# Altium project Motor_Driver_UCC272201ADR.PrjPcb
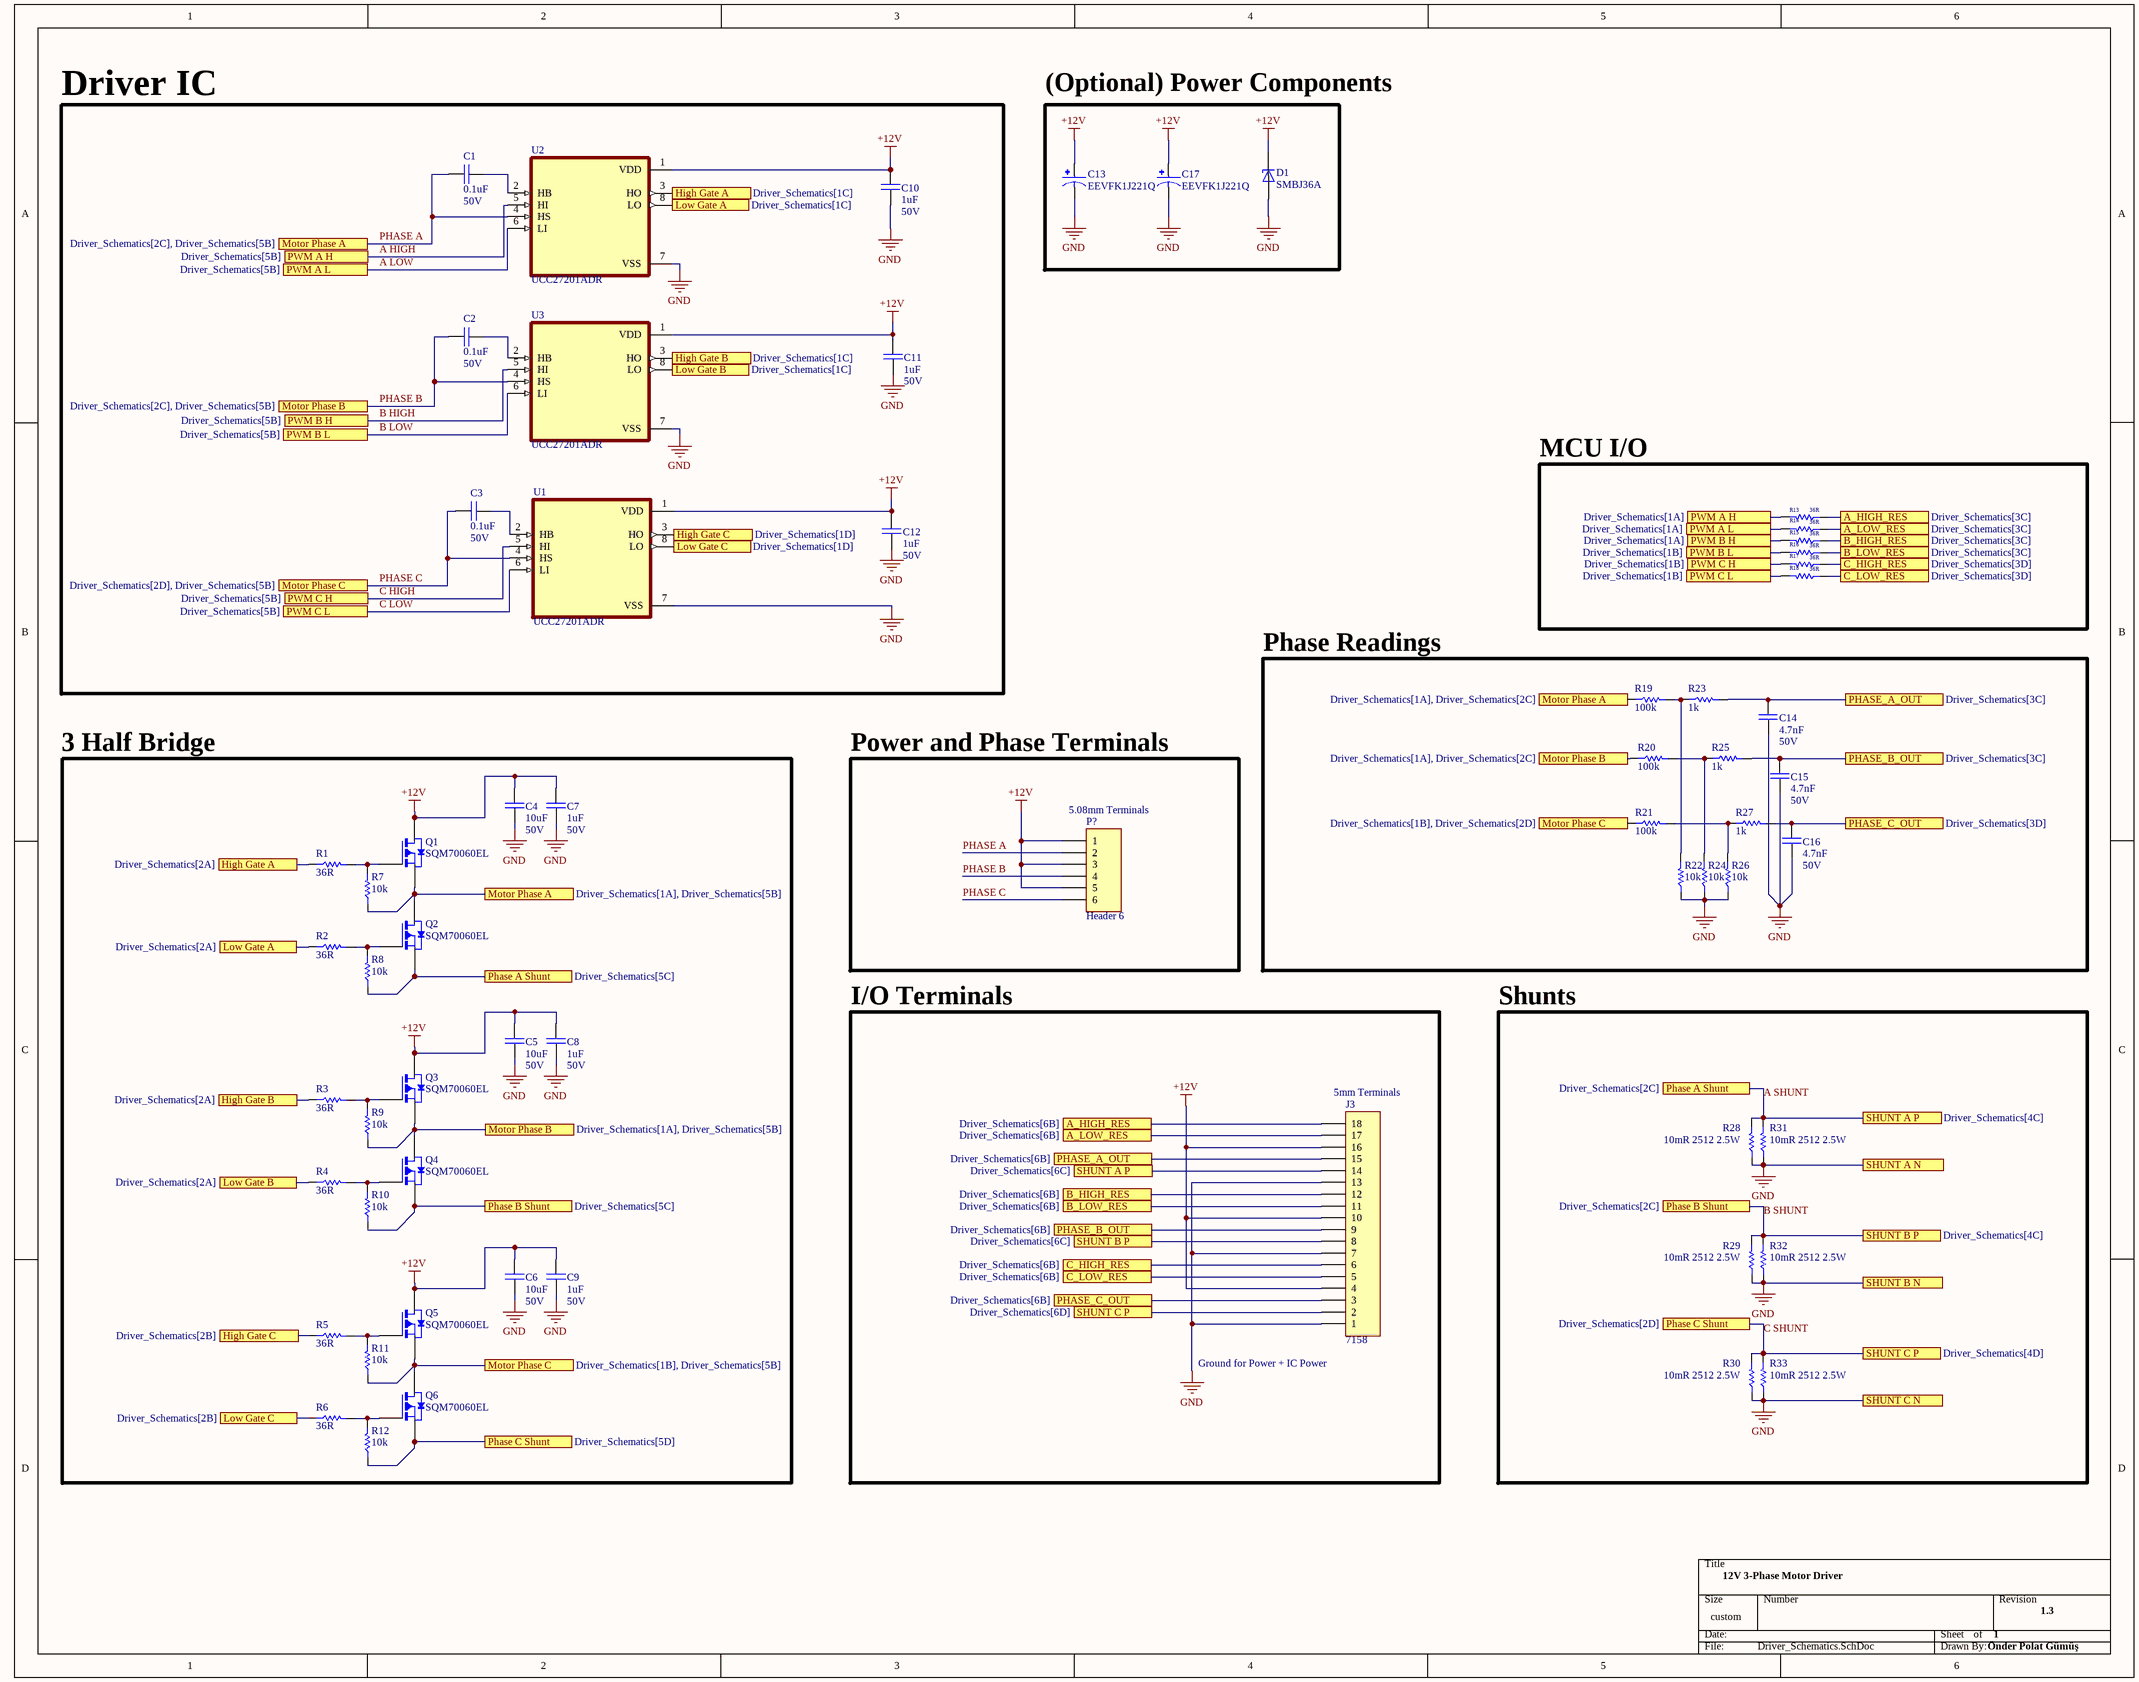
[diagram p0: Driver_Schematics.SchDoc]
1 sheet, 62 parts. Net scope: flat (ports and power ports of the same name join across sheets).
Board file: One_Layer_Driver_ PCB.PcbDoc

## Sheet Driver_Schematics.SchDoc
size 457 x 360 mm; SheetNumber: 1; SheetTotal: 1; SPICEModelCacheHAKLBCCJ: <root> / <DocumentId>HAKLBCCJ</DocumentId> / </root>

### Parts
C1  Rating: 50V  [CAP 1206/3216]  (hidden comment: 0.1uF)
C2  Rating: 50V  [CAP 1206/3216]  (hidden comment: 0.1uF)
C3  Rating: 50V  [CAP 1206/3216]  (hidden comment: 0.1uF)
C4  Rating: 50V  [CAP 1206/3216]  (hidden comment: 10uF)
C5  Rating: 50V  [CAP 1206/3216]  (hidden comment: 10uF)
C6  Rating: 50V  [CAP 1206/3216]  (hidden comment: 10uF)
C7  Rating: 50V  [CAP 1206/3216]  (hidden comment: 1uF)
C8  Rating: 50V  [CAP 1206/3216]  (hidden comment: 1uF)
C9  Rating: 50V  [CAP 1206/3216]  (hidden comment: 1uF)
C10  Rating: 50V  [CAP 1206/3216]  (hidden comment: 1uF)
C11  Rating: 50V  [CAP 1206/3216]  (hidden comment: 1uF)
C12  Rating: 50V  [CAP 1206/3216]  (hidden comment: 1uF)
C13  EEVFK1J221Q  [CAP_EEVFK1J221Q]
C14  Rating: 50V  [CAP 1206/3216]  (hidden comment: 4.7nF)
C15  Rating: 50V  [CAP 1206/3216]  (hidden comment: 4.7nF)
C16  Rating: 50V  [CAP 1206/3216]  (hidden comment: 4.7nF)
C17  EEVFK1J221Q  [CAP_EEVFK1J221Q]
D1  SMBJ36A  [DIOM4336X265N]
J3  Inflow: 7158  [HDR_THT_18F_2.54mm_RA]  (hidden comment: 18)
P?  Header 6  [HDR1X6]
Q1  SQM70060EL  [TO-263]
Q2  SQM70060EL  [TO-263]
Q3  SQM70060EL  [TO-263]
Q4  SQM70060EL  [TO-263]
Q5  SQM70060EL  [TO-263]
Q6  SQM70060EL  [TO-263]
R1  36R  [RES 1206 (3216X08L)]
R2  36R  [RES 1206 (3216X08L)]
R3  36R  [RES 1206 (3216X08L)]
R4  36R  [RES 1206 (3216X08L)]
R5  36R  [RES 1206 (3216X08L)]
R6  36R  [RES 1206 (3216X08L)]
R7  10k  [RES 1206 (3216X08L)]
R8  10k  [RES 1206 (3216X08L)]
R9  10k  [RES 1206 (3216X08L)]
R10  10k  [RES 1206 (3216X08L)]
R11  10k  [RES 1206 (3216X08L)]
R12  10k  [RES 1206 (3216X08L)]
R13  36R  [RES 1206 (3216X08L)]
R14  36R  [RES 1206 (3216X08L)]
R15  36R  [RES 1206 (3216X08L)]
R16  36R  [RES 1206 (3216X08L)]
R17  36R  [RES 1206 (3216X08L)]
R18  36R  [RES 1206 (3216X08L)]
R19  100k  [RES 1206 (3216X08L)]
R20  100k  [RES 1206 (3216X08L)]
R21  100k  [RES 1206 (3216X08L)]
R22  10k  [RES 1206 (3216X08L)]
R23  1k  [RES 1206 (3216X08L)]
R24  10k  [RES 1206 (3216X08L)]
R25  1k  [RES 1206 (3216X08L)]
R26  10k  [RES 1206 (3216X08L)]
R27  1k  [RES 1206 (3216X08L)]
R28  10mR 2512 2.5W  [Shunt_2512]
R29  10mR 2512 2.5W  [Shunt_2512]
R30  10mR 2512 2.5W  [Shunt_2512]
R31  10mR 2512 2.5W  [Shunt_2512]
R32  10mR 2512 2.5W  [Shunt_2512]
R33  10mR 2512 2.5W  [Shunt_2512]
U1  UCC27201ADR  [SOIC127P599X175-8N]
U2  UCC27201ADR  [SOIC127P599X175-8N]
U3  UCC27201ADR  [SOIC127P599X175-8N]

### Blocks framed on the sheet
Driver IC: C1-C3 C10-C12 U1-U3
(Optional) Power Components: C13 C17 D1
MCU I/O: R13-R18
Phase Readings: C14-C16 R19-R27
3 Half Bridge: C4-C9 Q1-Q6 R1-R12
Power and Phase Terminals: P?
I/O Terminals: J3
Shunts: R28-R33

### Ports
A_HIGH_RES (see Driver_Schematics[3C]), A_HIGH_RES (see Driver_Schematics[6B]), A_LOW_RES (see Driver_Schematics[3C]), A_LOW_RES (see Driver_Schematics[6B]), B_HIGH_RES (see Driver_Schematics[3C]), B_HIGH_RES (see Driver_Schematics[6B]), B_LOW_RES (see Driver_Schematics[3C]), B_LOW_RES (see Driver_Schematics[6B]), C_HIGH_RES (see Driver_Schematics[3D]), C_HIGH_RES (see Driver_Schematics[6B]), C_LOW_RES (see Driver_Schematics[3D]), C_LOW_RES (see Driver_Schematics[6B]), High Gate A (see Driver_Schematics[1C]), High Gate A (see Driver_Schematics[2A]), High Gate B (see Driver_Schematics[1C]), High Gate B (see Driver_Schematics[2A]), High Gate C (see Driver_Schematics[1D]), High Gate C (see Driver_Schematics[2B]), Low Gate A (see Driver_Schematics[1C]), Low Gate A (see Driver_Schematics[2A]), Low Gate B (see Driver_Schematics[1C]), Low Gate B (see Driver_Schematics[2A]), Low Gate C (see Driver_Schematics[1D]), Low Gate C (see Driver_Schematics[2B]), Motor Phase A (see Driver_Schematics[1A], Driver_Schematics[2C]), Motor Phase A (see Driver_Schematics[1A], Driver_Schematics[5B]), Motor Phase A (see Driver_Schematics[2C], Driver_Schematics[5B]), Motor Phase B (see Driver_Schematics[1A], Driver_Schematics[2C]), Motor Phase B (see Driver_Schematics[1A], Driver_Schematics[5B]), Motor Phase B (see Driver_Schematics[2C], Driver_Schematics[5B]), Motor Phase C (see Driver_Schematics[1B], Driver_Schematics[2D]), Motor Phase C (see Driver_Schematics[1B], Driver_Schematics[5B]), Motor Phase C (see Driver_Schematics[2D], Driver_Schematics[5B]), Phase A Shunt (see Driver_Schematics[2C]), Phase A Shunt (see Driver_Schematics[5C]), Phase B Shunt (see Driver_Schematics[2C]), Phase B Shunt (see Driver_Schematics[5C]), Phase C Shunt (see Driver_Schematics[2D]), Phase C Shunt (see Driver_Schematics[5D]), PHASE_A_OUT (see Driver_Schematics[3C]), PHASE_A_OUT (see Driver_Schematics[6B]), PHASE_B_OUT (see Driver_Schematics[3C]), PHASE_B_OUT (see Driver_Schematics[6B]), PHASE_C_OUT (see Driver_Schematics[3D]), PHASE_C_OUT (see Driver_Schematics[6B]), PWM A H (see Driver_Schematics[1A]), PWM A H (see Driver_Schematics[5B]), PWM A L (see Driver_Schematics[1A]), PWM A L (see Driver_Schematics[5B]), PWM B H (see Driver_Schematics[1A]), PWM B H (see Driver_Schematics[5B]), PWM B L (see Driver_Schematics[1B]), PWM B L (see Driver_Schematics[5B]), PWM C H (see Driver_Schematics[1B]), PWM C H (see Driver_Schematics[5B]), PWM C L (see Driver_Schematics[1B]), PWM C L (see Driver_Schematics[5B]), SHUNT A N, SHUNT A P (see Driver_Schematics[4C]), SHUNT A P (see Driver_Schematics[6C]), SHUNT B N, SHUNT B P (see Driver_Schematics[4C]), SHUNT B P (see Driver_Schematics[6C]), SHUNT C N, SHUNT C P (see Driver_Schematics[4D]), SHUNT C P (see Driver_Schematics[6D])

### Nets
+12V: C4.1 C5.1 C6.1 C7.1 C8.1 C9.1 C10.1 C11.1 C12.1 C13.1 C17.1 D1.C J3.4 J3.10 J3.16 P?.1 P?.3 P?.5 Q1.4(D) Q3.4(D) Q5.4(D) U1.1(VDD) U2.1(VDD) U3.1(VDD)
GND: C4.2 C5.2 C6.2 C7.2 C8.2 C9.2 C10.2 C11.2 C12.2 C13.2 C14.2 C15.2 C16.2 C17.2 D1.A J3.1 J3.7 J3.13 R22.1 R24.1 R26.1 R28.1 R29.1 R30.1 R31.1 R32.1 R33.1 U1.7(VSS) U2.7(VSS) U3.7(VSS) ; port SHUNT A N, port SHUNT B N, port SHUNT C N
A HIGH: R13.1 U2.5(HI) ; port PWM A H
A LOW: R14.1 U2.6(LI) ; port PWM A L
A SHUNT: J3.14 Q2.3(S) R8.1 R28.2 R31.2 ; port Phase A Shunt, port SHUNT A P
B HIGH: R15.1 U3.5(HI) ; port PWM B H
B LOW: R16.1 U3.6(LI) ; port PWM B L
B SHUNT: J3.8 Q4.3(S) R10.1 R29.2 R32.2 ; port Phase B Shunt, port SHUNT B P
C HIGH: R17.1 U1.5(HI) ; port PWM C H
C LOW: R18.1 U1.6(LI) ; port PWM C L
C SHUNT: J3.2 Q6.3(S) R12.1 R30.2 R33.2 ; port Phase C Shunt, port SHUNT C P
PHASE A: C1.1 P?.2 Q1.3(S) Q2.4(D) R7.1 R19.1 U2.4(HS) ; port Motor Phase A
PHASE B: C2.1 P?.4 Q3.3(S) Q4.4(D) R9.1 R20.1 U3.4(HS) ; port Motor Phase B
PHASE C: C3.1 P?.6 Q5.3(S) Q6.4(D) R11.1 R21.1 U1.4(HS) ; port Motor Phase C
NetC1_2: C1.2 U2.2(HB)
NetC2_2: C2.2 U3.2(HB)
NetC3_2: C3.2 U1.2(HB)
NetC14_1: C14.1 J3.15 R23.2 ; port PHASE_A_OUT
NetC15_1: C15.1 J3.9 R25.2 ; port PHASE_B_OUT
NetC16_1: C16.1 J3.3 R27.2 ; port PHASE_C_OUT
NetJ3_5: J3.5 R18.2 ; port C_LOW_RES
NetJ3_6: J3.6 R17.2 ; port C_HIGH_RES
NetJ3_11: J3.11 R16.2 ; port B_LOW_RES
NetJ3_12: J3.12 R15.2 ; port B_HIGH_RES
NetJ3_17: J3.17 R14.2 ; port A_LOW_RES
NetJ3_18: J3.18 R13.2 ; port A_HIGH_RES
NetQ1_1: Q1.1(G) R1.2 R7.2
NetQ2_1: Q2.1(G) R2.2 R8.2
NetQ3_1: Q3.1(G) R3.2 R9.2
NetQ4_1: Q4.1(G) R4.2 R10.2
NetQ5_1: Q5.1(G) R5.2 R11.2
NetQ6_1: Q6.1(G) R6.2 R12.2
NetR1_1: R1.1 U2.3(HO) ; port High Gate A
NetR2_1: R2.1 U2.8(LO) ; port Low Gate A
NetR3_1: R3.1 U3.3(HO) ; port High Gate B
NetR4_1: R4.1 U3.8(LO) ; port Low Gate B
NetR5_1: R5.1 U1.3(HO) ; port High Gate C
NetR6_1: R6.1 U1.8(LO) ; port Low Gate C
NetR19_2: R19.2 R22.2 R23.1
NetR20_2: R20.2 R24.2 R25.1
NetR21_2: R21.2 R26.2 R27.1

### Notes on the sheet
- (near P?) 5.08mm Terminals
- (near J3) 5mm Terminals
- (near J3) Ground for Power + IC Power
- 12V 3-Phase Motor Driver
- 1
- 1.3
- Önder Polat Gümüş

### Library data of the parts
C1-C12 C14-C16 = Cap_Multi_SMD: Bipolar ceramic capacitor SMD; Inflow: inflow?; Type: Type?; Validation: Valid; Package: Package?
  C1-C3: Value: 0.1uF
  C4-C6: Value: 10uF
  C7-C12: Value: 1uF
  C14-C16: Value: 4.7nF
C13 = EEVFK1J221Q: 220µF 63V Aluminum Electrolytic Capacitors Radial, Can - SMD 5000 Hrs @ 105Â°C; MF: Panasonic Electronic; Price: None; Value: *; Check_prices: https://www.snapeda.com/parts/EEVFK1J221Q/Panasonic%20Electronic%20Components/view-part/47452/?ref=eda; Purchase-URL: https://pricing.snapeda.com/search/part/EEVFK1J221Q/?ref=eda; Package: RADIAL-2 Panasonic; SnapEDA_Link: https://www.snapeda.com/parts/EEVFK1J221Q/Panasonic%20Electronic%20Components/view-part/47452/?ref=snap; Availability: In Stock; MP: EEVFK1J221Q
C17 = EEVFK1J221Q: 220ÂµF 63V Aluminum Electrolytic Capacitors Radial, Can - SMD 5000 Hrs @ 105Â°C; MF: Panasonic Electronic; Price: None; Value: *; Check_prices: https://www.snapeda.com/parts/EEVFK1J221Q/Panasonic%20Electronic%20Components/view-part/47452/?ref=eda; Purchase-URL: https://pricing.snapeda.com/search/part/EEVFK1J221Q/?ref=eda; Package: RADIAL-2 Panasonic; SnapEDA_Link: https://www.snapeda.com/parts/EEVFK1J221Q/Panasonic%20Electronic%20Components/view-part/47452/?ref=snap; Availability: In Stock; MP: EEVFK1J221Q
D1 = SMBJ36A: 58.1V Clamp 10.4A Ipp Tvs Diode Surface Mount DO-214AA (SMBJ); MF: Littelfuse Inc.; SnapEDA_Link: https://www.snapeda.com/parts/SMBJ36A/Littelfuse/view-part/?ref=snap; Package: DO-214AA Littelfuse; Value: *; MP: SMBJ36A; Check_prices: https://www.snapeda.com/parts/SMBJ36A/Littelfuse/view-part/?ref=eda
J3 = Con_FPH_18x1_R_THT_2.54: Header, single row, 18 pin; Rating: Rating?; Validation: NT; Value: 18; Package: Package?; Type: Type?
P? = Header 6: Header, 6-Pin; LatestRevisionDate: 17-Jul-2002; LatestRevisionNote: Re-released for DXP Platform.; Publisher: Altium Limited
Q1-Q6 = Semi_MOSFET_IRF4905S: P-Channel MOSFET; Rating: Rating?; Validation: Valid; Type: P-Channel; Package: TO-263; Value: IRF4905S
  Q1-Q5: SQM70060EL: SQM70060EL
  Q6: Inflow: SQM70060EL
R1-R27 = Res_SMD_1206: Resistor; Inflow: inflow?; Rating: 0.25W; Validation: Valid; Package: 1206; Type: 10%
  R1-R6 R13-R18: Value: 36R
  R7-R12 R22 R24 R26: Value: 10k
  R19-R21: Value: 100k
  R23 R25 R27: Value: 1k
R28-R33 = Res_Shunt_SMD: Resistor; Inflow: inflow?; Rating: Precision; Validation: NT; Package: Package?; Type: Shunt; Value: 10mR 2512 2.5W
U1-U3 = UCC27201ADR: 3-A, 120-V half bridge gate driver with 8-V UVLO and negative voltage handling; MF: Texas Instruments; SnapEDA_Link: https://www.snapeda.com/parts/UCC27201ADR/Texas+Instruments/view-part/?ref=snap; Package: SOIC-8 Texas Instruments; Value: *; MP: UCC27201ADR; Check_prices: https://www.snapeda.com/parts/UCC27201ADR/Texas+Instruments/view-part/?ref=eda